# Altium schematic sheet Power.SchDoc: Schematic design of the Power Section
size 420 x 297 mm; Date: 24/07/2023; ApprovedBy: Sir Pramitha; CheckedBy: Sir Pramitha; Author: Intern Dilini; CompanyName: SLTMobitel; DrawnBy: Intern Dilini; Engineer: Sir Pramitha; Organization: SLT; Address1: Embryo Innovation Center; Address2: Telecom head office; DocumentNumber: 4; SheetNumber: 4; SheetTotal: 5; Time: 12:20
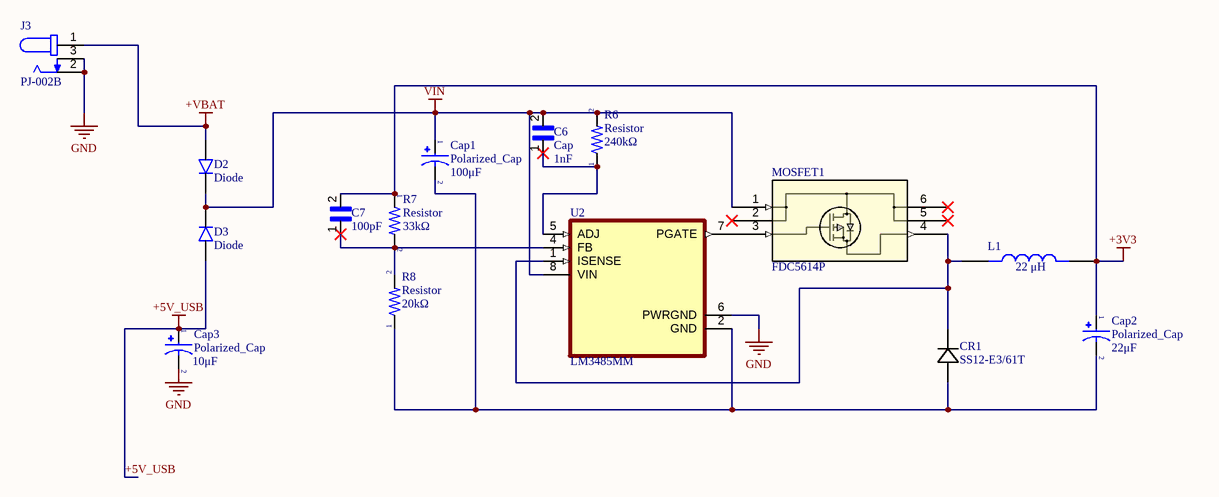
[diagram p0: Power.SchDoc]

## Parts
C6  Cap  Parameter 1: 1nF  [Cap_0805]
C7  Parameter 1: 100pF  [Cap_0805]  (hidden comment: Cap)
Cap1  Polarized_Cap  Parameter 1: 100μF  [CAP_B3528]
Cap2  Polarized_Cap  Parameter 1: 22μF  [CAP_B3528]
Cap3  Polarized_Cap  Parameter 1: 10μF  [CAP_B3528]
CR1  SS12-E3/61T  [SMA(DO-214AC)_VIS]
D2  Diode  [DO-214AC]
D3  Diode  [DO-214AC]
J3  PJ-002B  [CUI_PJ-002B]
L1  value 22 μH  [IND - 0805]  (hidden comment: MLZ2012N220LT000)
MOSFET1  FDC5614P  [TSOT23-6_419BL_ONS]
R6  Resistor  Parameter 1: 240kΩ  [Res_0603]
R7  Resistor  Parameter 1: 33kΩ  [Res_0603]
R8  Resistor  Parameter 1: 20kΩ  [Res_0603]
U2  LM3485MM  [SOP65P490X110-8N]

## Nets
+3V3: C7.2 Cap2.1 L1.2 R7.1
+5V_USB: Cap3.1 D3.A
+VBAT: D2.A J3.1
GND: Cap3.2 J3.2 J3.3 U2.6(PWRGND)
VIN: C6.2 Cap1.1 D2.C D3.C MOSFET1.1 R6.2 U2.8(VIN)
NetC6_1: C6.1 R6.1 U2.5(ADJ)
NetC7_1: C7.1 R7.2 R8.2 U2.4(FB)
NetCap1_2: Cap1.2 Cap2.2 CR1.2 R8.1 U2.2(GND)
NetCR1_1: CR1.1 L1.1 MOSFET1.4 U2.1(ISENSE)
NetMOSFET1_3: MOSFET1.3 U2.7(PGATE)

Not connected (* = marked no-connect by the designer): MOSFET1 2* 5* 6*

## Notes on the sheet
- THIS DOCUMENT AND THE DATA DISCLOSED HEREIN OR
- HEREWITH IS THE PROPERTY OF ALTIUM LIMITED AND MAY
- DWG NO:
- REVISION
- REV:
- DESCRIPTION
- DATE
- APPROVED
- BE FREELY DISTRIBUTED IN WHOLE. NO RIGHTS ARE
- RESERVED OR EXPRESS OR IMPLIED WARANTEE GIVEN.
- ENG:
- APPROVALS
- PROJECT
- DSN:
- CHK:
- REFERENCE DOCUMENTS
- PROJECT REVISION:
- TITLE
- DOCUMENT REVISION:
- DESIGN ITEM:
- BOM:
- FAB DWG:
- PCB DWG:
- ASSY DWG:
- SCALE:
- A3
- SIZE
- CAGE CODE
- FILE NAME
- DWG NO.
- SHEET
- OF
- REV

## Library data of the parts
CR1 = SS12-E3/61T: No Description Available; Mfr_Name: Vishay
J3 = PJ-002B: 2.5 x 6.5 mm, 2.5 A, Horizontal, Through Hole, Dc Power Jack Connector; MF: CUI Devices; SnapEDA_Link: https://www.snapeda.com/parts/PJ-002B/CUI+Devices/view-part/?ref=snap; Package: None; MP: PJ-002B; CUI_purchase_URL: https://www.cuidevices.com/product/interconnect/connectors/dc-power-connectors/jacks/pj-002b?utm_source=snapeda.com&utm_medium=referral&utm_campaign=snapedaBOM; Check_prices: https://www.snapeda.com/parts/PJ-002B/CUI+Devices/view-part/?ref=eda; Purchase-URL: https://pricing.snapeda.com/search/part/PJ-002B/?ref=eda; Price: None; Value: *; Availability: In Stock
L1 = MLZ2012N220LT000: 22ÂµH Shielded Multilayer Inductor 300mA 670mOhm 0805 (2012 Metric); MF: TDK; Availability: In Stock; SnapEDA_Link: https://www.snapeda.com/parts/MLZ2012N220LT000/TDK/view-part/?ref=snap; Check_prices: https://www.snapeda.com/parts/MLZ2012N220LT000/TDK/view-part/?ref=eda; Price: None; Package: 2012 Bourns; Purchase-URL: https://pricing.snapeda.com/search/part/MLZ2012N220LT000/?ref=eda; MP: MLZ2012N220LT000
MOSFET1 = FDC5614P: No Description Available; Mfr_Name: onsemi; RefDes: RefDes; Type: Type
U2 = LM3485MM: 4.5-35V, Hysteretic Non-Synchronous PFET Buck Controller; MF: Texas Instruments; MP: LM3485MMX/NOPB; Package: VSSOP-8 Texas Instruments; Price: None; Check_prices: https://www.snapeda.com/parts/LM3485MMX/NOPB/Texas+Instruments/view-part/?ref=eda; Value: *; SnapEDA_Link: https://www.snapeda.com/parts/LM3485MMX/NOPB/Texas+Instruments/view-part/?ref=snap; Availability: In Stock; Purchase-URL: https://pricing.snapeda.com/search?q=LM3485MMX/NOPB&ref=eda